# Altium schematic sheet Power.SchDoc
size A4
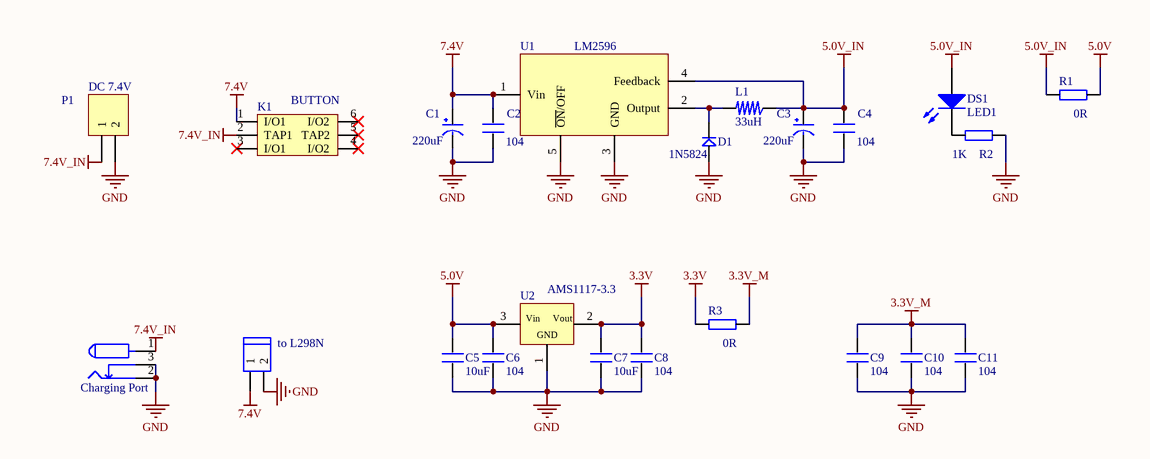
[diagram p0: Power.SchDoc]

## Parts
C1  220uF  [CC6.56.5]
C2  104  [0603P]
C3  220uF  [CC6.56.5]
C4  104  [0603P]
C5  10uF  [0603P]
C6  104  [0603P]
C7  10uF  [0603P]
C8  104  [0603P]
C9  104  [0603P]
C10  104  [0603P]
C11  104  [0603P]
D1  1N5824  [DIODE_SOP]
DC_IN1  Charging Port  [DC10B]
DS1  LED1  [SMDLED]
K1  BUTTON  [BTN8.5*8.5]
L1  33uH  [CD54]
P1  DC 7.4V  [XH2.54-2P]
R1  0R  [0603P]
R2  1K  [0603P]
R3  0R  [0603P]
RS1  to L298N  [HEAD2L-0.8]
U1  LM2596  [TO-263-5]
U2  AMS1117-3.3  [SOT223-4L]

## Nets
3.3V: C7.2 C8.2 R3.1 U2.2(Vout)
3.3V_M: C9.2 C10.2 C11.2 R3.2
5.0V: C5.2 C6.2 R1.2 U2.3(Vin)
5.0V_IN: C3.1(VCC) C4.2 DS1.1(A) L1.2 R1.1 U1.4(Feedback)
7.4V: C1.1(VCC) C2.2 K1.1(I/O1) RS1.1 U1.1(Vin)
7.4V_IN: DC_IN1.1 K1.2(TAP1) P1.1
GND: C1.2(GND) C2.1 C3.2(GND) C4.1 C5.1 C6.1 C7.1 C8.1 C9.1 C10.1 C11.1 D1.1 DC_IN1.2 DC_IN1.3 P1.2 R2.2 RS1.2 U1.3(GND) U1.5(~{ON}/OFF) U2.1(GND)
NetD1_2: D1.2 L1.1 U1.2(Output)
NetDS1_2: DS1.2(K) R2.1

Not connected (* = marked no-connect by the designer): K1 3(I/O1)* 4(I/O2)* 5(TAP2)* 6(I/O2)*

## Library data of the parts
C1 C3 = CAP
C2 C4-C11 = C
D1 = D
DC_IN1 = POW
DS1 = LED2: Typical RED, GREEN, YELLOW, AMBER GaAs LED; Published: 8-Jun-2000; LatestRevisionDate: 17-Jul-2002; LatestRevisionNote: Re-released for DXP Platform.; PackageDocument: Feb-2002; PackageReference: 3.2X1.6X1.1; Publisher: Altium Limited
L1 = L
P1 = Header-2: Header, 2-Pin
R1-R3 = R
RS1 = H
U1 = LM2596: LM2596 - 5.0
U2 = AMS1117